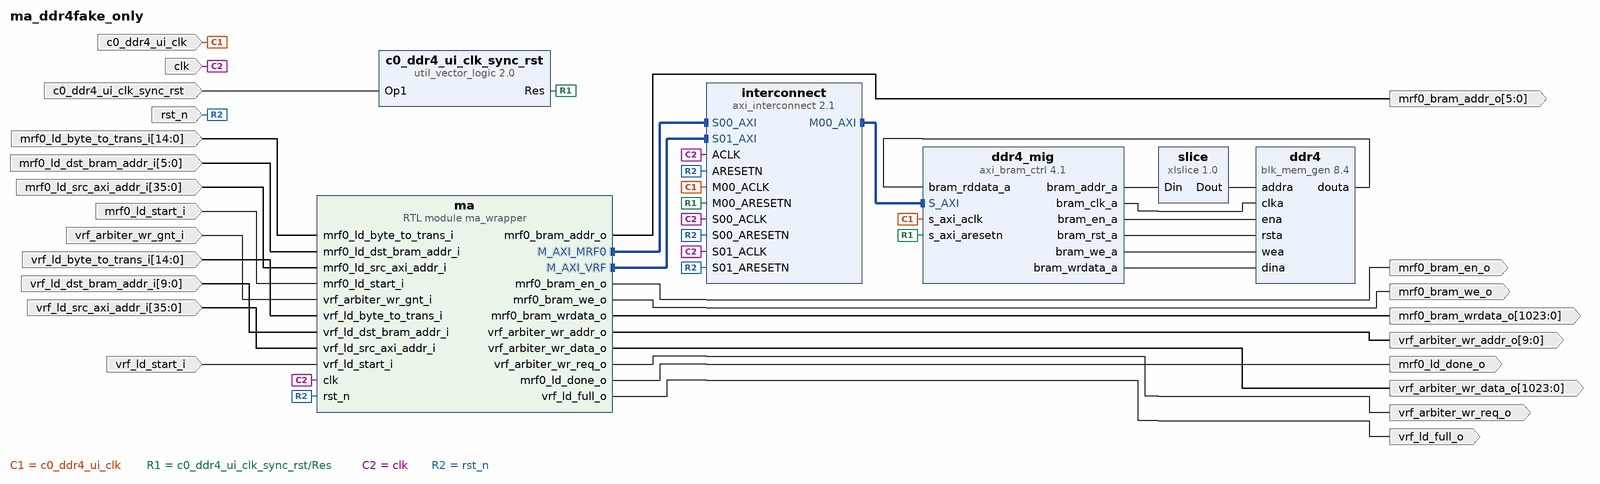
[diagram p0: block diagram of the top level]
# Vivado block design ma_ddr4fake_only, xcu250-figd2104-2L-e, Vivado 2024.1
create_bd_design ma_ddr4fake_only

create_bd_port -dir I -type clk c0_ddr4_ui_clk
set_property -dict {CONFIG.FREQ_HZ 300000000} [get_bd_ports c0_ddr4_ui_clk]
create_bd_port -dir I -type rst c0_ddr4_ui_clk_sync_rst
set_property -dict {CONFIG.POLARITY ACTIVE_HIGH} [get_bd_ports c0_ddr4_ui_clk_sync_rst]
create_bd_port -dir I -type clk clk
set_property -dict {CONFIG.ASSOCIATED_RESET rst_n CONFIG.FREQ_HZ 200000000} [get_bd_ports clk]
create_bd_port -dir I -from 14 -to 0 mrf0_ld_byte_to_trans_i
create_bd_port -dir O mrf0_ld_done_o
create_bd_port -dir I -from 5 -to 0 mrf0_ld_dst_bram_addr_i
create_bd_port -dir I -from 35 -to 0 mrf0_ld_src_axi_addr_i
create_bd_port -dir I mrf0_ld_start_i
create_bd_port -dir I -type rst rst_n
create_bd_port -dir I -from 14 -to 0 vrf_ld_byte_to_trans_i
create_bd_port -dir I -from 9 -to 0 vrf_ld_dst_bram_addr_i
create_bd_port -dir O vrf_ld_full_o
create_bd_port -dir I -from 35 -to 0 vrf_ld_src_axi_addr_i
create_bd_port -dir I vrf_ld_start_i
create_bd_port -dir O -from 9 -to 0 vrf_arbiter_wr_addr_o
create_bd_port -dir O -from 1023 -to 0 vrf_arbiter_wr_data_o
create_bd_port -dir O vrf_arbiter_wr_req_o
create_bd_port -dir I vrf_arbiter_wr_gnt_i
create_bd_port -dir O -from 1023 -to 0 mrf0_bram_wrdata_o
create_bd_port -dir O mrf0_bram_en_o
create_bd_port -dir O mrf0_bram_we_o
create_bd_port -dir O -from 5 -to 0 mrf0_bram_addr_o

create_bd_cell -type ip -vlnv xilinx.com:ip:util_vector_logic:2.0 c0_ddr4_ui_clk_sync_rst
set_property -dict {CONFIG.C_OPERATION not CONFIG.C_SIZE 1} [get_bd_cells c0_ddr4_ui_clk_sync_rst]
create_bd_cell -type ip -vlnv xilinx.com:ip:blk_mem_gen:8.4 ddr4
set_property -dict [list \
  CONFIG.Coe_File ../../../../../../dram_init.coe \
  CONFIG.EN_SAFETY_CKT false \
  CONFIG.Enable_32bit_Address true \
  CONFIG.Fill_Remaining_Memory_Locations true \
  CONFIG.Load_Init_File true \
  CONFIG.Register_PortA_Output_of_Memory_Primitives false \
  CONFIG.Remaining_Memory_Locations deadbeef \
  CONFIG.Write_Width_A 512 \
  CONFIG.use_bram_block Stand_Alone \
] [get_bd_cells ddr4]
create_bd_cell -type ip -vlnv xilinx.com:ip:axi_bram_ctrl:4.1 ddr4_mig
set_property -dict {CONFIG.DATA_WIDTH 512 CONFIG.SINGLE_PORT_BRAM 1} [get_bd_cells ddr4_mig]
create_bd_cell -type ip -vlnv xilinx.com:ip:axi_interconnect:2.1 interconnect
set_property -dict [list \
  CONFIG.NUM_MI 1 \
  CONFIG.NUM_SI 2 \
  CONFIG.S00_HAS_DATA_FIFO 2 \
  CONFIG.S01_HAS_DATA_FIFO 2 \
  CONFIG.STRATEGY 2 \
] [get_bd_cells interconnect]
create_bd_cell -type module -reference ma_wrapper ma
create_bd_cell -type ip -vlnv xilinx.com:ip:xlslice:1.0 slice
set_property -dict {CONFIG.DIN_FROM 31 CONFIG.DIN_WIDTH 34} [get_bd_cells slice]

# ---- connections ----

connect_bd_intf_net -intf_net ma_wrapper_0_M_AXI_C0_DDR4 [get_bd_intf_pins interconnect/M00_AXI] [get_bd_intf_pins ddr4_mig/S_AXI]
connect_bd_intf_net -intf_net ma_wrapper_M_AXI_MRF0 [get_bd_intf_pins ma/M_AXI_MRF0] [get_bd_intf_pins interconnect/S00_AXI]
connect_bd_intf_net -intf_net ma_wrapper_M_AXI_VRF [get_bd_intf_pins ma/M_AXI_VRF] [get_bd_intf_pins interconnect/S01_AXI]
connect_bd_net -net c0_ddr4_ui_clk_0_1 [get_bd_ports c0_ddr4_ui_clk] [get_bd_pins ddr4_mig/s_axi_aclk] [get_bd_pins interconnect/M00_ACLK]
connect_bd_net -net c0_ddr4_ui_clk_sync_rst_0_1 [get_bd_ports c0_ddr4_ui_clk_sync_rst] [get_bd_pins c0_ddr4_ui_clk_sync_rst/Op1]
connect_bd_net [get_bd_pins c0_ddr4_ui_clk_sync_rst/Res] [get_bd_pins ddr4_mig/s_axi_aresetn] [get_bd_pins interconnect/M00_ARESETN]
connect_bd_net -net clk_0_1 [get_bd_ports clk] \
  [get_bd_pins ma/clk] [get_bd_pins interconnect/ACLK] [get_bd_pins interconnect/S00_ACLK] \
  [get_bd_pins interconnect/S01_ACLK]
connect_bd_net [get_bd_pins ddr4/douta] [get_bd_pins ddr4_mig/bram_rddata_a]
connect_bd_net [get_bd_pins ddr4_mig/bram_addr_a] [get_bd_pins slice/Din]
connect_bd_net [get_bd_pins ddr4_mig/bram_clk_a] [get_bd_pins ddr4/clka]
connect_bd_net [get_bd_pins ddr4_mig/bram_en_a] [get_bd_pins ddr4/ena]
connect_bd_net [get_bd_pins ddr4_mig/bram_rst_a] [get_bd_pins ddr4/rsta]
connect_bd_net [get_bd_pins ddr4_mig/bram_we_a] [get_bd_pins ddr4/wea]
connect_bd_net [get_bd_pins ddr4_mig/bram_wrdata_a] [get_bd_pins ddr4/dina]
connect_bd_net [get_bd_pins ma/mrf0_bram_addr_o] [get_bd_ports mrf0_bram_addr_o]
connect_bd_net [get_bd_pins ma/mrf0_bram_en_o] [get_bd_ports mrf0_bram_en_o]
connect_bd_net [get_bd_pins ma/mrf0_bram_we_o] [get_bd_ports mrf0_bram_we_o]
connect_bd_net [get_bd_pins ma/mrf0_bram_wrdata_o] [get_bd_ports mrf0_bram_wrdata_o]
connect_bd_net [get_bd_pins ma/vrf_arbiter_wr_addr_o] [get_bd_ports vrf_arbiter_wr_addr_o]
connect_bd_net [get_bd_pins ma/vrf_arbiter_wr_data_o] [get_bd_ports vrf_arbiter_wr_data_o]
connect_bd_net [get_bd_pins ma/vrf_arbiter_wr_req_o] [get_bd_ports vrf_arbiter_wr_req_o]
connect_bd_net -net ma_wrapper_0_mrf0_ld_done_o [get_bd_pins ma/mrf0_ld_done_o] [get_bd_ports mrf0_ld_done_o]
connect_bd_net -net ma_wrapper_0_vrf_ld_full_o [get_bd_pins ma/vrf_ld_full_o] [get_bd_ports vrf_ld_full_o]
connect_bd_net -net mrf0_ld_byte_to_trans_i_0_1 [get_bd_ports mrf0_ld_byte_to_trans_i] [get_bd_pins ma/mrf0_ld_byte_to_trans_i]
connect_bd_net -net mrf0_ld_dst_bram_addr_i_0_1 [get_bd_ports mrf0_ld_dst_bram_addr_i] [get_bd_pins ma/mrf0_ld_dst_bram_addr_i]
connect_bd_net -net mrf0_ld_src_axi_addr_i_0_1 [get_bd_ports mrf0_ld_src_axi_addr_i] [get_bd_pins ma/mrf0_ld_src_axi_addr_i]
connect_bd_net -net mrf0_ld_start_i_0_1 [get_bd_ports mrf0_ld_start_i] [get_bd_pins ma/mrf0_ld_start_i]
connect_bd_net -net rst_n_0_1 [get_bd_ports rst_n] \
  [get_bd_pins ma/rst_n] [get_bd_pins interconnect/S01_ARESETN] [get_bd_pins interconnect/S00_ARESETN] \
  [get_bd_pins interconnect/ARESETN]
connect_bd_net [get_bd_pins slice/Dout] [get_bd_pins ddr4/addra]
connect_bd_net -net vrf_arbiter_wr_gnt_i_0_1 [get_bd_ports vrf_arbiter_wr_gnt_i] [get_bd_pins ma/vrf_arbiter_wr_gnt_i]
connect_bd_net -net vrf_ld_byte_to_trans_i_0_1 [get_bd_ports vrf_ld_byte_to_trans_i] [get_bd_pins ma/vrf_ld_byte_to_trans_i]
connect_bd_net -net vrf_ld_dst_bram_addr_i_0_1 [get_bd_ports vrf_ld_dst_bram_addr_i] [get_bd_pins ma/vrf_ld_dst_bram_addr_i]
connect_bd_net -net vrf_ld_src_axi_addr_i_0_1 [get_bd_ports vrf_ld_src_axi_addr_i] [get_bd_pins ma/vrf_ld_src_axi_addr_i]
connect_bd_net -net vrf_ld_start_i_0_1 [get_bd_ports vrf_ld_start_i] [get_bd_pins ma/vrf_ld_start_i]

# ---- address map ----
assign_bd_address -offset 0x000000000 -range 16G -target_address_space [get_bd_addr_spaces ma/M_AXI_MRF0] [get_bd_addr_segs ddr4_mig/S_AXI/Mem0]
assign_bd_address -offset 0x000000000 -range 16G -target_address_space [get_bd_addr_spaces ma/M_AXI_VRF] [get_bd_addr_segs ddr4_mig/S_AXI/Mem0]

validate_bd_design
save_bd_design
